# Altium schematic sheet USB.SchDoc
size A4
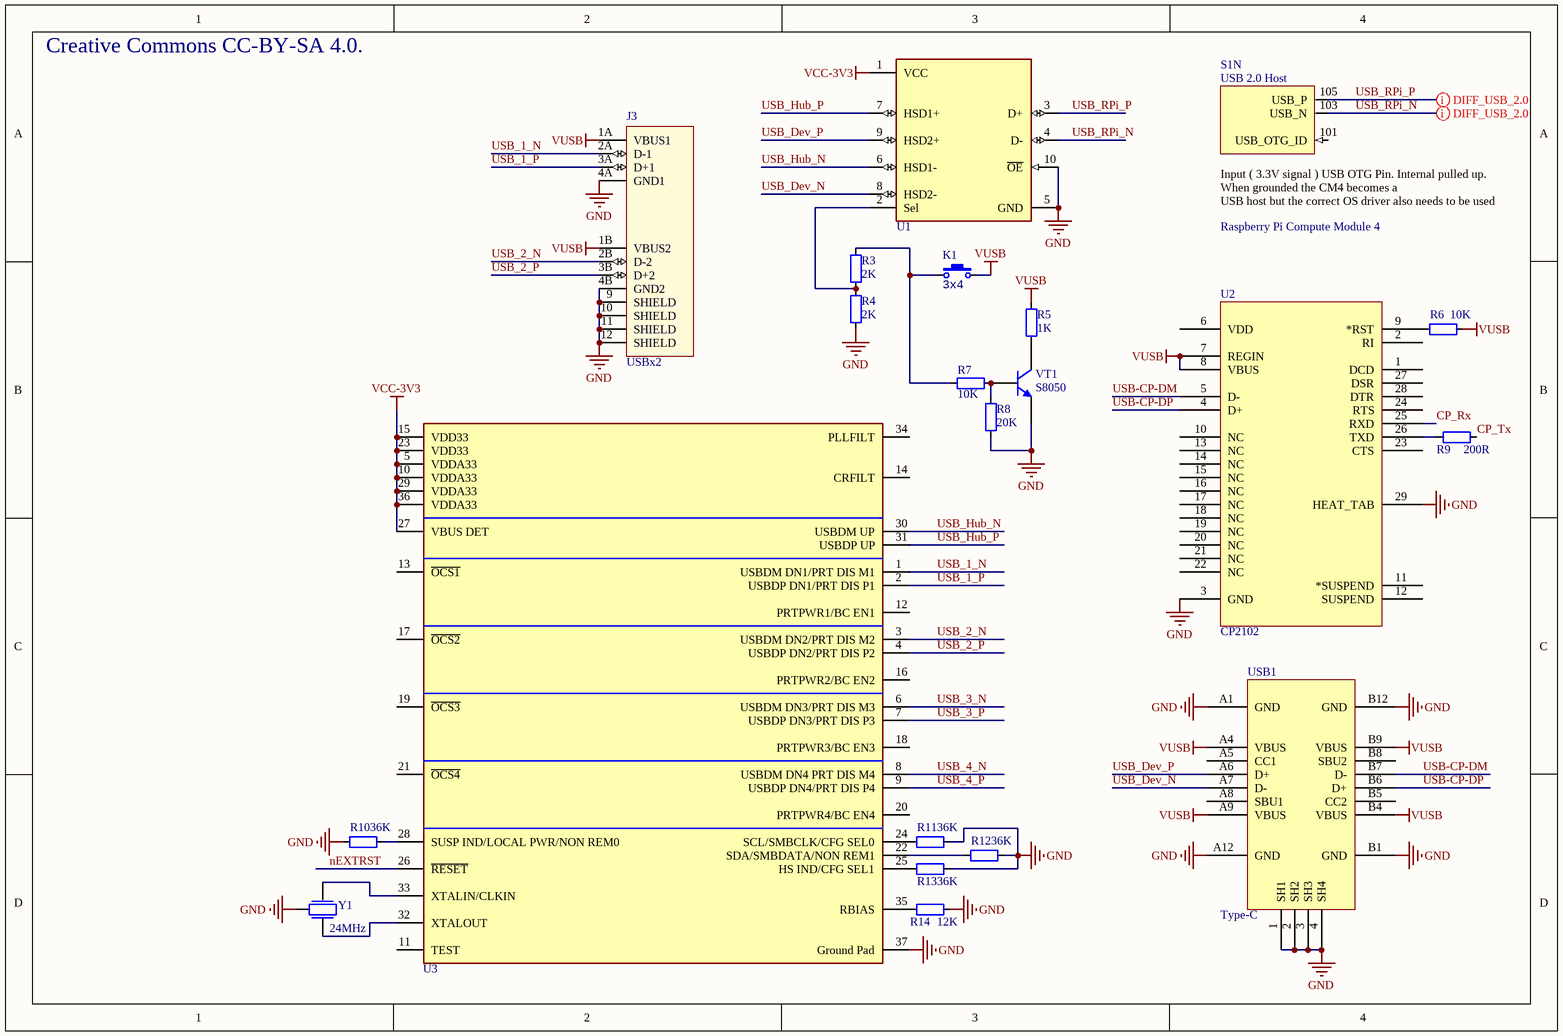
[diagram p0: USB.SchDoc]

## Parts
J3  USBx2  [USBx2]
K1  value 3x4  [ButtonTACT_3x4x2_180H]  (hidden comment: TACT 2P)
R3  2K  [RES_0402]
R4  2K  [RES_0402]
R5  1K  [RES_0402]
R6  10K  [RES_0402]
R7  10K  [RES_0402]
R8  20K  [RES_0402]
R9  200R  [RES_0402]
R10  36K  [RES_0402]
R11  36K  [RES_0402]
R12  36K  [RES_0402]
R13  36K  [RES_0402]
R14  12K  [RES_0402]
S1  Raspberry Pi Compute Module 4  [CM4-F40C-100DS-0.4v_1.5mm_0mm]  (part N of 21)
U1  FSUSB42MUX  [MSOP-10]  (value not drawn)
U2  CP2102  [QFN-28]
U3  USB2514BT-I-M2  [QFN-36]  (value not drawn)
USB1  Type-C  [Type-C-TOP]
VT1  S8050  [SMT_TRIODE_NPN]
Y1  24MHz  [晶振-3P]

## Nets
GND: J3.4A(GND1) J3.4B(GND2) J3.9(SHIELD) J3.10(SHIELD) J3.11(SHIELD) J3.12(SHIELD) R4.2 R8.1 R10.2 R11.1 R12.1 R13.1 R14.1 U1.5(GND) U1.10(~{OE}) U2.3(GND) U2.29(HEAT_TAB) U3.37(Ground_Pad) USB1.1(SH1) USB1.2(SH2) USB1.3(SH3) USB1.4(SH4) USB1.A1(GND) USB1.A12(GND) USB1.B1(GND) USB1.B12(GND) VT1.2(E) Y1.2
VCC-3V3: U1.1(VCC) U3.5(VDDA33) U3.10(VDDA33) U3.15(VDD33) U3.23(VDD33) U3.27(VBUS_DET) U3.29(VDDA33) U3.36(VDDA33)
VUSB: J3.1A(VBUS1) J3.1B(VBUS2) K1.2 R5.1 R6.1 U2.7(REGIN) U2.8(VBUS) USB1.A4(VBUS) USB1.A9(VBUS) USB1.B4(VBUS) USB1.B9(VBUS)
CP_Rx: U2.25(RXD)
CP_Tx: R9.1
nEXTRST: U3.26(~{RESET})
USB-CP-DM: U2.5(D-) USB1.B7(D-)
USB-CP-DP: U2.4(D+) USB1.B6(D+)
USB_1_N: J3.2A(D-1) U3.1(USBDM_DN1/PRT_DIS_M1)
USB_1_P: J3.3A(D+1) U3.2(USBDP_DN1/PRT_DIS_P1)
USB_2_N: J3.2B(D-2) U3.3(USBDM_DN2/PRT_DIS_M2)
USB_2_P: J3.3B(D+2) U3.4(USBDP_DN2/PRT_DIS_P2)
USB_3_N: U3.6(USBDM_DN3/PRT_DIS_M3)
USB_3_P: U3.7(USBDP_DN3/PRT_DIS_P3)
USB_4_N: U3.8(USBDM_DN4_PRT_DIS_M4)
USB_4_P: U3.9(USBDP_DN4/PRT_DIS_P4)
USB_Dev_N: U1.8(HSD2-) USB1.A7(D-)
USB_Dev_P: U1.9(HSD2+) USB1.A6(D+)
USB_Hub_N: U1.6(HSD1-) U3.30(USBDM_UP)
USB_Hub_P: U1.7(HSD1+) U3.31(USBDP_UP)
USB_RPi_N: S1.103(USB_N) U1.4(D-)
USB_RPi_P: S1.105(USB_P) U1.3(D+)
NetK1_1: K1.1 R3.1 R7.1
NetR3_2: R3.2 R4.1 U1.2(Sel)
NetR5_2: R5.2 VT1.3(C)
NetR6_2: R6.2 U2.9(*RST)
NetR7_2: R7.2 R8.2 VT1.1(B)
NetR9_2: R9.2 U2.26(TXD)
NetR10_1: R10.1 U3.28(SUSP_IND/LOCAL_PWR/NON_REM0)
NetR11_2: R11.2 U3.24(SCL/SMBCLK/CFG_SEL0)
NetR12_2: R12.2 U3.22(SDA/SMBDATA/NON_REM1)
NetR13_2: R13.2 U3.25(HS_IND/CFG_SEL1)
NetR14_2: R14.2 U3.35(RBIAS)
NetU3_32: U3.32(XTALOUT) Y1.1
NetU3_33: U3.33(XTALIN/CLKIN) Y1.3

Not connected (* = marked no-connect by the designer): S1 101(USB_OTG_ID); U2 1(DCD) 2(RI) 6(VDD) 10(NC) 11(*SUSPEND) 12(SUSPEND) 13(NC) 14(NC) 15(NC) 16(NC) 17(NC) 18(NC) 19(NC) 20(NC) 21(NC) 22(NC) 23(CTS) 24(RTS) 27(DSR) 28(DTR); U3 11(TEST) 12(PRTPWR1/BC_EN1) 13(~{OCS1}) 14(CRFILT) 16(PRTPWR2/BC_EN2) 17(~{OCS2}) 18(PRTPWR3/BC_EN3) 19(~{OCS3}) 20(PRTPWR4/BC_EN4) 21(~{OCS4}) 34(PLLFILT); USB1 A5(CC1) A8(SBU1) B5(CC2) B8(SBU2)

## Layout directives
differential pair; differential pair class DIFF_90Ohm_USB2.0; differential pair class DIFF_USB2.0; net class USB2.0_480Mbps: USB_RPi_N, USB_RPi_P

## Notes on the sheet
- Creative Commons CC-BY-SA 4.0.
- Title
- Size:
- Date:
- A4
- Number:
- Time:
- Revision:
- Sheet
- of
- Q-Wave Systems Co.,Ltd
- 65/2 Moo 1 Beung
- Sriracha Chonburi
- Thailand
- File:
- (in symbol CM4, part N) USB 2.0 Host; Input ( 3.3V signal ) USB OTG Pin. Internal pulled up. When grounded the CM4 becomes a / USB host but the correct OS driver also needs to be used

## Library data of the parts
J3 = USBx2: Usb Conn, Dual Rcpt, 2.0, 2port, 8pos; MF: Global Connector Technology; MP: USB1035-GF-P-0-B-B; Availability: Good; Price: 0.42 USD; SnapEDA_Link: https://www.snapeda.com/parts/USB1035-GF-P-0-B-B/Global%20Connector%20Technology/view-part/?ref=snap; Package: None; Value: *
K1 = ButtonTACT_3x4x2_180: Button; type: TACT 2P
R3-R14 = 电阻-0402: Resistor; Value: 22R
S1 = CM4: Raspberry Pi Compute Module 4 by Amornthep Phunsin
U2 = CP2102: USB转TTL; PART DESC: SINGLE-CHIP USB TO UART BRIDGE, QFN28, RoHS.; MFG #1: SILICON LABS; PART NUMBER: CP2102; Value: Value; RefDes: RefDes; Type: DEV
USB1 = USB-Type-C-TOP
VT1 = SMT_TRIODE_NPN: Surface mount NPN transistor, package SOT-23
Y1 = 晶振-3Pin: 村田贴片